# EAGLE design Sprite_CC1310_Development (EAGLE 8.5.2)
Assembly variants: hdmid
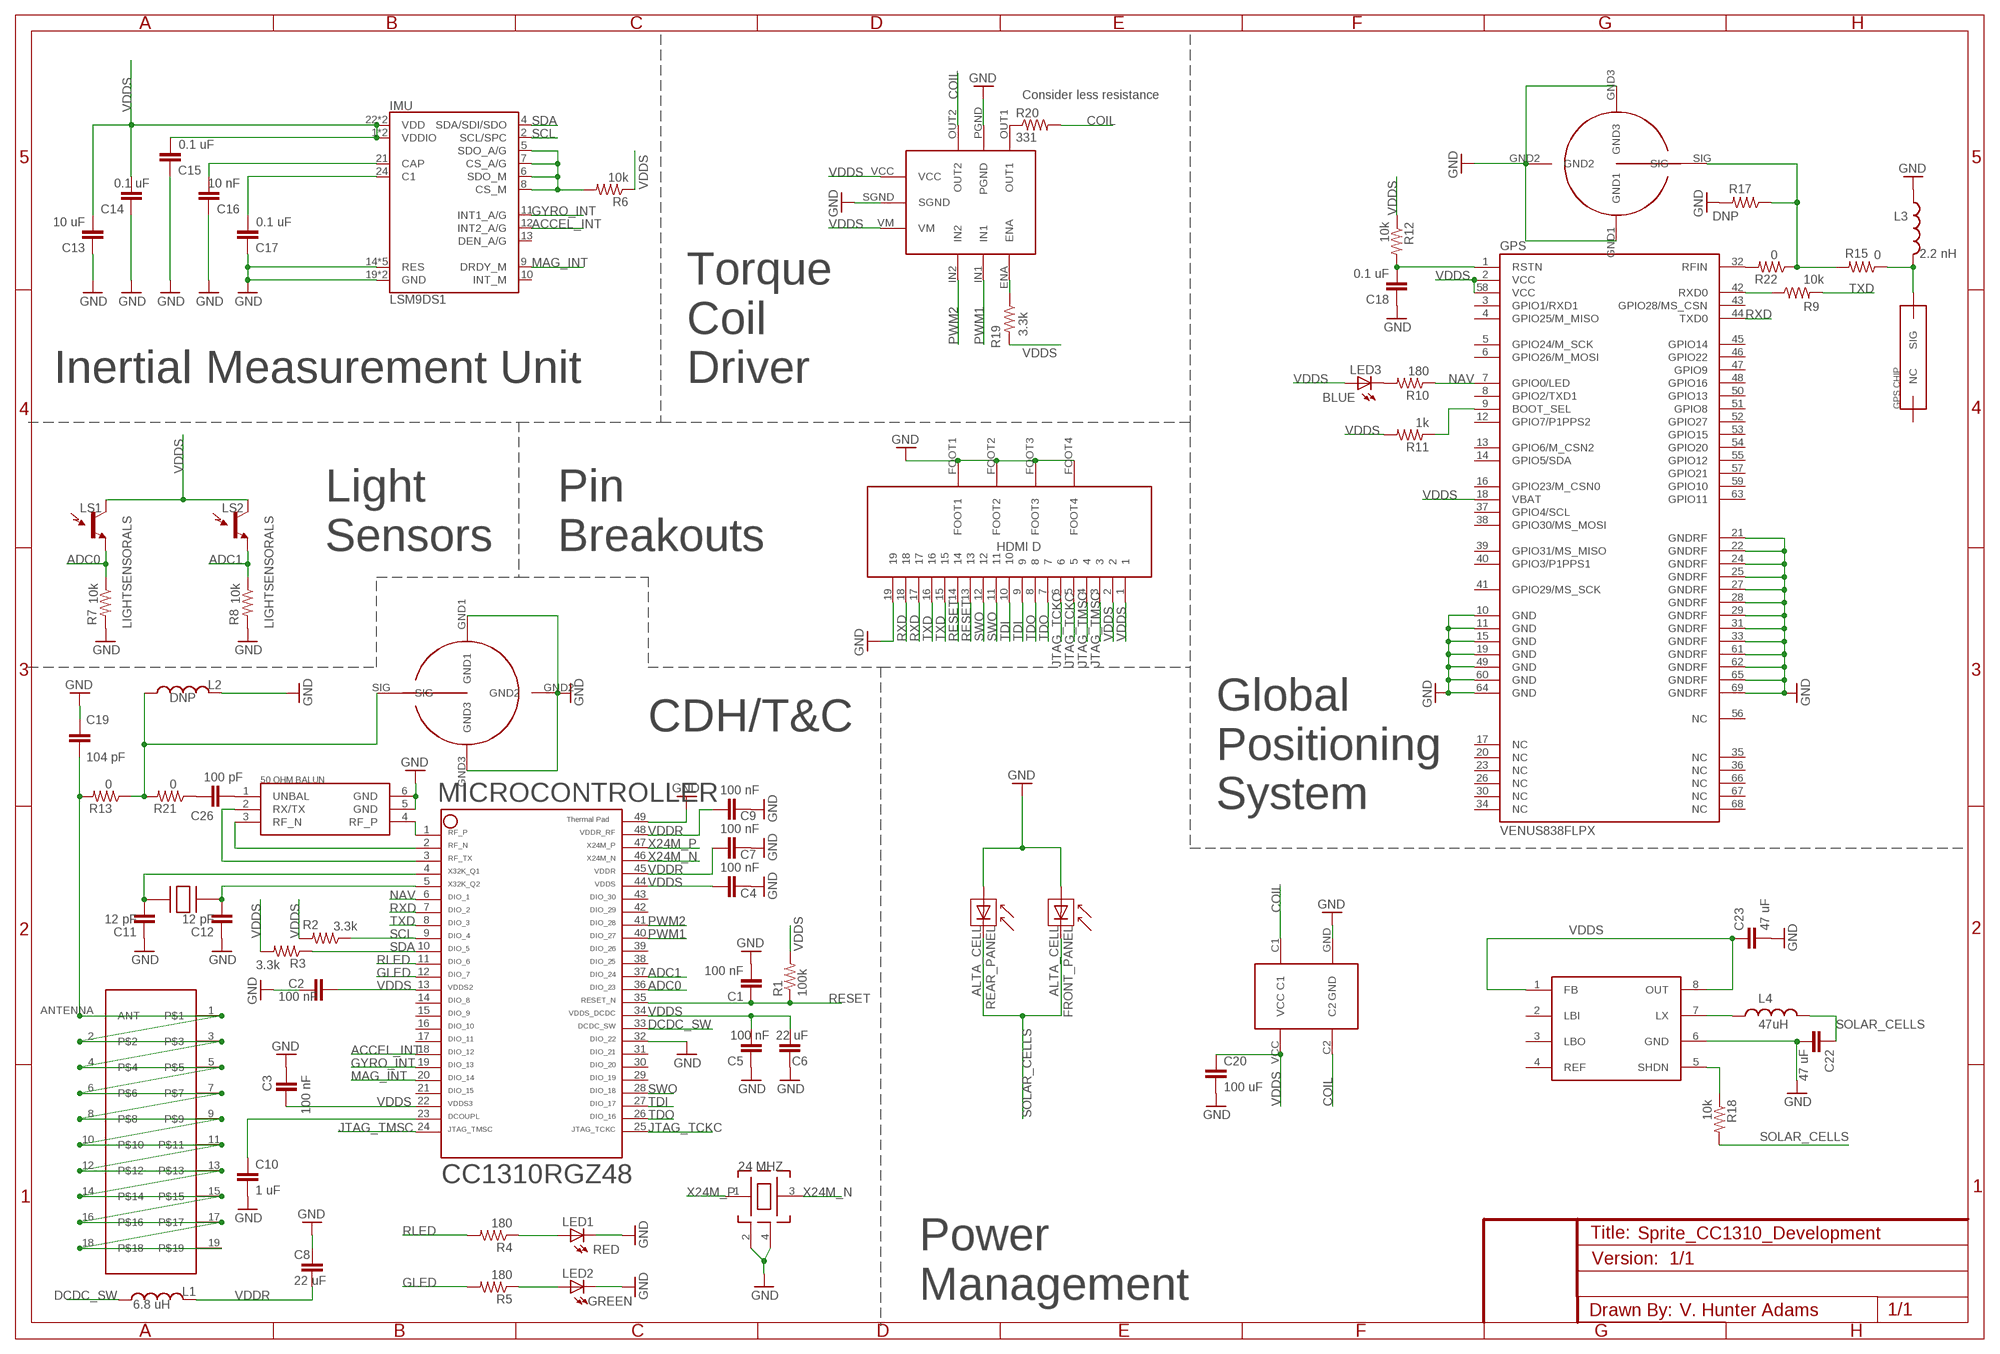
[diagram p0: schematic, sheet 1]

## Parts
32.768  FC-135  [FC-135]
BALUN  JOHANSON_BALUN  [JOHANSON_BALUN]
C1  100 nF  CAP0402-CAP  [0402-CAP]
C2  100 nF  CAP0402-CAP  [0402-CAP]
C3  100 nF  CAP0402-CAP  [0402-CAP]
C4  100 nF  CAP0402-CAP  [0402-CAP]
C5  100 nF  CAP0402-CAP  [0402-CAP]
C6  22 uF  CAP0402-CAP  [0402-CAP]
C7  100 nF  CAP0402-CAP  [0402-CAP]
C8  22 uF  CAP0402-CAP  [0402-CAP]
C9  100 nF  CAP0402-CAP  [0402-CAP]
C10  1 uF  CAP0402-CAP  [0402-CAP]
C11  12 pF  CAP0402-CAP  [0402-CAP]
C12  12 pF  CAP0402-CAP  [0402-CAP]
C13  10 uF  CAP0402-CAP  [0402-CAP]
C14  0.1 uF  CAP0402-CAP  [0402-CAP]
C15  0.1 uF  CAP0402-CAP  [0402-CAP]
C16  10 nF  CAP0402-CAP  [0402-CAP]
C17  0.1 uF  CAP0402-CAP  [0402-CAP]
C18  0.1 uF  CAP0402-CAP  [0402-CAP]
C19  104 pF  CAP0603-CAP  [0603-CAP]
C20  100 uF  CAP0805  [0805]
C22  47 uF  CAP0805  [0805]
C23  47 uF  CAP0805  [0805]
C26  100 pF  CAP0402-CAP  [0402-CAP]
FRONT_PANEL  ALTA_CELL  [ALTA_CELL]
GPS  VENUS838FLPX  [VENUS838FLPX]
IMU  LSM9DS1  [LGA24-8X4]
L1  6.8 uH  INDUCTOR0603  [0603]
L2  DNP  INDUCTOR0603  [0603]
L3  2.2 nH  INDUCTOR0603  [0603]
L4  47uH  INDUCTOR0603  [0603]
LED1  RED  LED0603  [LED-0603]
LED2  GREEN  LED0603  [LED-0603]
LED3  BLUE  LED0603  [LED-0603]
LS1  LIGHTSENSORALS  [ALS-PT19]
LS2  LIGHTSENSORALS  [ALS-PT19]
MICROCONTROLLER  CC1310  [CC1310]
R1  100k  RESISTOR0402-RES  [0402-RES]
R2  3.3k  RESISTOR0402-RES  [0402-RES]
R3  3.3k  RESISTOR0402-RES  [0402-RES]
R4  180  RESISTOR0402-RES  [0402-RES]
R5  180  RESISTOR0402-RES  [0402-RES]
R6  10k  RESISTOR0402-RES  [0402-RES]
R7  10k  RESISTOR0402-RES  [0402-RES]
R8  10k  RESISTOR0402-RES  [0402-RES]
R9  10k  RESISTOR0402-RES  [0402-RES]
R10  180  RESISTOR0402-RES  [0402-RES]
R11  1k  RESISTOR0402-RES  [0402-RES]
R12  10k  RESISTOR0402-RES  [0402-RES]
R13  0  RESISTOR0603-RES  [0603-RES]
R15  0  RESISTOR0603-RES  [0603-RES]
R17  DNP  RESISTOR0603-RES  [0603-RES]
R18  10k  RESISTOR0402-RES  [0402-RES]
R19  3.3k  RESISTOR0402-RES  [0402-RES]
R20  331  RESISTOR0402-RES  [0402-RES]
R21  0  RESISTOR0603-RES  [0603-RES]
R22  0  RESISTOR0603-RES  [0603-RES]
REAR_PANEL  ALTA_CELL  [ALTA_CELL]
TSX3225  TSX-3225  [TSX-3225]
U$1  HDMID  [HDMID]
U$2  LV8417CS  [LV8417CS]
U$3  MM5329-2700  [MM5829-2700]
U$4  PANASONIC_RECTIFIER  [PANASONIC_RECTIFIER]
U$5  JOHANSON_GPS_CHIP  [JOHANSON_GPS_CHIP]
U$6  PCB_ANTENNA  [PCB_ANTENNA]
U$7  MM5329-2700  [MM5829-2700]
U$8  L6920  [L6920]

## Nets
ACCEL_INT: IMU.12(INT2_A/G) MICROCONTROLLER.18
ADC0: LS1.E(E1) MICROCONTROLLER.36 R7.1
ADC1: LS2.E(E1) MICROCONTROLLER.37 R8.1
ANTENNA: C19.2 R13.2 U$6.1 U$6.2 U$6.3 U$6.4 U$6.5 U$6.6 U$6.7 U$6.8 U$6.9 U$6.10 U$6.11 U$6.12 U$6.13 U$6.14 U$6.15 U$6.16 U$6.17 U$6.18 U$6.19 U$6.ANTENNA(ANT)
COIL: R20.2 U$2.OUT2 U$4.C1 U$4.C2
DCDC_SW: L1.1 MICROCONTROLLER.33
GLED: MICROCONTROLLER.12 R5.2
GND: BALUN.5(GND) BALUN.6(GND) C1.2 C2.2 C3.2 C4.2 C5.2 C6.2 C7.2 C8.2 C9.2 C10.2 C11.2 C12.2 C13.2 C14.2 C15.2 C16.2 C17.2 C18.2 C19.1 C20.2 C22.2 C23.2 FRONT_PANEL.- GPS.10(GND) GPS.11(GND) GPS.15(GND) GPS.19(GND) GPS.21(GNDRF) GPS.22(GNDRF) GPS.24(GNDRF) GPS.25(GNDRF) GPS.27(GNDRF) GPS.28(GNDRF) GPS.29(GNDRF) GPS.31(GNDRF) GPS.33(GNDRF) GPS.49(GND) GPS.60(GND) GPS.61(GNDRF) GPS.62(GNDRF) GPS.64(GND) GPS.65(GNDRF) GPS.69(GNDRF) IMU.14(RES) IMU.15(RES) IMU.16(RES) IMU.17(RES) IMU.18(RES) IMU.19(GND) IMU.20(GND) L2.2 L3.1 LED1.C LED2.C MICROCONTROLLER.32 MICROCONTROLLER.49 R7.2 R8.2 R17.2 REAR_PANEL.- TSX3225.2 TSX3225.4 U$1.19 U$1.FOOT1 U$1.FOOT2 U$1.FOOT3 U$1.FOOT4 U$2.PGND U$2.SGND U$3.GND1 U$3.GND2 U$3.GND3 U$4.GND U$7.GND1 U$7.GND2 U$7.GND3 U$8.6(GND)
GYRO_INT: IMU.11(INT1_A/G) MICROCONTROLLER.19
JTAG_TCKC: MICROCONTROLLER.25 U$1.5 U$1.6
JTAG_TMSC: MICROCONTROLLER.24 U$1.3 U$1.4
MAG_INT: IMU.9(DRDY_M) MICROCONTROLLER.20
N$1: C10.1 MICROCONTROLLER.23
N$2: 32.768.P2 C11.1 MICROCONTROLLER.4
N$3: 32.768.P1 C12.1 MICROCONTROLLER.5
N$4: LED1.A R4.1
N$5: LED2.A R5.1
N$6: IMU.5(SDO_A/G) IMU.6(SDO_M) IMU.7(CS_A/G) IMU.8(CS_M) R6.2
N$7: GPS.42(RXD0) R9.1
N$8: C16.1 IMU.21(CAP)
N$9: C17.1 IMU.24(C1)
N$11: LED3.C R10.2
N$12: GPS.9(BOOT_SEL) R11.1
N$13: C18.1 GPS.1(RSTN) R12.2
N$14: R15.2 R17.1 R22.1 U$7.SIG
N$15: L3.2 R15.1 U$5.SIG
N$19: R19.1 U$2.ENA
N$20: R20.1 U$2.OUT1
N$21: BALUN.1(UNBAL) C26.2
N$22: BALUN.4(RF_P) MICROCONTROLLER.1
N$23: BALUN.3(RF_N) MICROCONTROLLER.2
N$24: BALUN.2(RX/TX) MICROCONTROLLER.3
N$25: GPS.32(RFIN) R22.2
N$26: L2.1 R13.1 R21.2 U$3.SIG
N$27: C26.1 R21.1
N$41: R18.1 U$8.5(SHDN)
N$48: L4.1 U$8.7(LX)
NAV: GPS.7(GPIO0/LED) MICROCONTROLLER.6 R10.1
PWM1: MICROCONTROLLER.40 U$2.IN1
PWM2: MICROCONTROLLER.41 U$2.IN2
RESET: C1.1 MICROCONTROLLER.35 R1.1 U$1.13 U$1.14
RLED: MICROCONTROLLER.11 R4.2
RXD: GPS.44(TXD0) MICROCONTROLLER.7 U$1.17 U$1.18
SCL: IMU.2(SCL/SPC) MICROCONTROLLER.9 R2.1
SDA: IMU.4(SDA/SDI/SDO) MICROCONTROLLER.10 R3.1
SOLAR_CELLS: C22.1 FRONT_PANEL.+ L4.2 R18.2 REAR_PANEL.+
SWO: MICROCONTROLLER.28 U$1.11 U$1.12
TDI: MICROCONTROLLER.27 U$1.9 U$1.10
TDO: MICROCONTROLLER.26 U$1.7 U$1.8
TXD: MICROCONTROLLER.8 R9.2 U$1.15 U$1.16
VDDR: C7.1 C8.1 C9.1 L1.2 MICROCONTROLLER.45 MICROCONTROLLER.48
VDDS: C2.1 C3.1 C4.1 C5.1 C6.1 C13.1 C14.1 C15.1 C20.1 C23.1 GPS.2(VCC) GPS.18(VBAT) GPS.58(VCC) IMU.1(VDDIO) IMU.3(VDDIO) IMU.22(VDD) IMU.23(VDD) LED3.A LS1.C(C1) LS2.C(C1) MICROCONTROLLER.13 MICROCONTROLLER.22 MICROCONTROLLER.34 MICROCONTROLLER.44 R1.2 R2.2 R3.2 R6.1 R11.2 R12.1 R19.2 U$1.1 U$1.2 U$2.VCC U$2.VM U$4.VCC U$8.1(FB) U$8.8(OUT)
X24M_N: MICROCONTROLLER.46 TSX3225.3
X24M_P: MICROCONTROLLER.47 TSX3225.1
Unconnected: GPS.3(GPIO1/RXD1) GPS.4(GPIO25/M_MISO) GPS.5(GPIO24/M_SCK) GPS.6(GPIO26/M_MOSI) GPS.8(GPIO2/TXD1) GPS.12(GPIO7/P1PPS2) GPS.13(GPIO6/M_CSN2) GPS.14(GPIO5/SDA) GPS.16(GPIO23/M_CSN0) GPS.17(NC) GPS.20(NC) GPS.23(NC) GPS.26(NC) GPS.30(NC) GPS.34(NC) GPS.35(NC) GPS.36(NC) GPS.37(GPIO4/SCL) GPS.38(GPIO30/MS_MOSI) GPS.39(GPIO31/MS_MISO) GPS.40(GPIO3/P1PPS1) GPS.41(GPIO29/MS_SCK) GPS.43(GPIO28/MS_CSN) GPS.45(GPIO14) GPS.46(GPIO22) GPS.47(GPIO9) GPS.48(GPIO16) GPS.50(GPIO13) GPS.51(GPIO8) GPS.52(GPIO27) GPS.53(GPIO15) GPS.54(GPIO20) GPS.55(GPIO12) GPS.56(NC) GPS.57(GPIO21) GPS.59(GPIO10) GPS.63(GPIO11) GPS.66(NC) GPS.67(NC) GPS.68(NC) IMU.10(INT_M) IMU.13(DEN_A/G) MICROCONTROLLER.14 MICROCONTROLLER.15 MICROCONTROLLER.16 MICROCONTROLLER.17 MICROCONTROLLER.21 MICROCONTROLLER.29 MICROCONTROLLER.30 MICROCONTROLLER.31 MICROCONTROLLER.38 MICROCONTROLLER.39 MICROCONTROLLER.42 MICROCONTROLLER.43 U$5.NC U$8.2(LBI) U$8.3(LBO) U$8.4(REF)

## Notes on the sheet
- Consider less resistance
- Inertial Measurement Unit
- Torque
  Coil
  Driver
- Light
  Sensors
- Pin
  Breakouts
- CDH/T&C
- Global
  Positioning
  System
- Power
  Management

## Library data of the parts
32.768 = FC-135:FC-135: FC-135 32.768KA-AG0
BALUN = JOHANSON_BALUN:JOHANSON_BALUN
C1-C20 C22 C23 C26 = SparkFun:CAP: Capacitor Standard 0603 ceramic capacitor, and 0.1" leaded capacitor.
FRONT_PANEL REAR_PANEL = ALTA_CELL:ALTA_CELL
GPS = VENUS838FLPX:VENUS838FLPX: Venus838FLPx-L
IMU = SparkFun-Sensors:LSM9DS1: LSM9DS1 3D accelerometer, gyroscope & magnetometer The LSM9DS1 is a system-in-package featuring a 3D digital linear acceleration sensor, a 3D digital angular rate sensor, and a 3D digital magnetic sensor. The LSM9DS1 has a linear acceleration full scale of ±2g/±4g/±8/±16 g, a magnetic field full scale of ±4/±8/±12/±16 gauss and an angular rate of ±245/±500/±2000 dps. The LSM9DS1 includes an I2 C serial bus interface supporting standard and fast mode (100 kHz and 400 kHz) and an SPI serial standard interface. Magnetic, accelerometer and gyroscope sensing can be enabled or set in power-down mode separately for smart power management. The LSM9DS1 is available in a plastic land grid array package (LGA) and it is guaranteed to operate over an extended temperature range from -40 °C to +85 °C.; PROD_ID: IC-12536
L1-L4 = SparkFun:INDUCTOR: Inductors Basic Inductor/Choke - 0603 and 1206. Footprints are not proven and vary greatly between part numbers.
LED1-LED3 = SparkFun:LED: LEDs Standard schematic elements and footprints for 5mm, 3mm, 1206, and 0603 sized LEDs. 5mm - Spark Fun Electronics SKU : COM-00529 (and others)
LS1 LS2 = SparkFun-Sensors:LIGHTSENSOR: Ambient Light Sensor Simple light detection sensor. Output varies with light intensity input. Spark Fun Electronics SKU : COM-08348; PROD_ID: IC-11836
MICROCONTROLLER = CC1310RGZ48:CC1310: CC1310 RGZ48 package
R1-R13 R15 R17-R22 = SparkFun:RESISTOR: Resistor Basic schematic elements and footprints for 0603, 1206, and PTH resistors.
TSX3225 = TSX-3225:TSX-3225
U$1 = HDMID:HDMID
U$2 = LV8417CS:LV8417CS
U$3 U$7 = MM5329-2700:MM5329-2700
U$4 = Panasonic_Rectifier:PANASONIC_RECTIFIER
U$5 = johanson_gps_chip:JOHANSON_GPS_CHIP
U$6 = PCB_ANTENNA:PCB_ANTENNA
U$8 = L6920:L6920

## Board
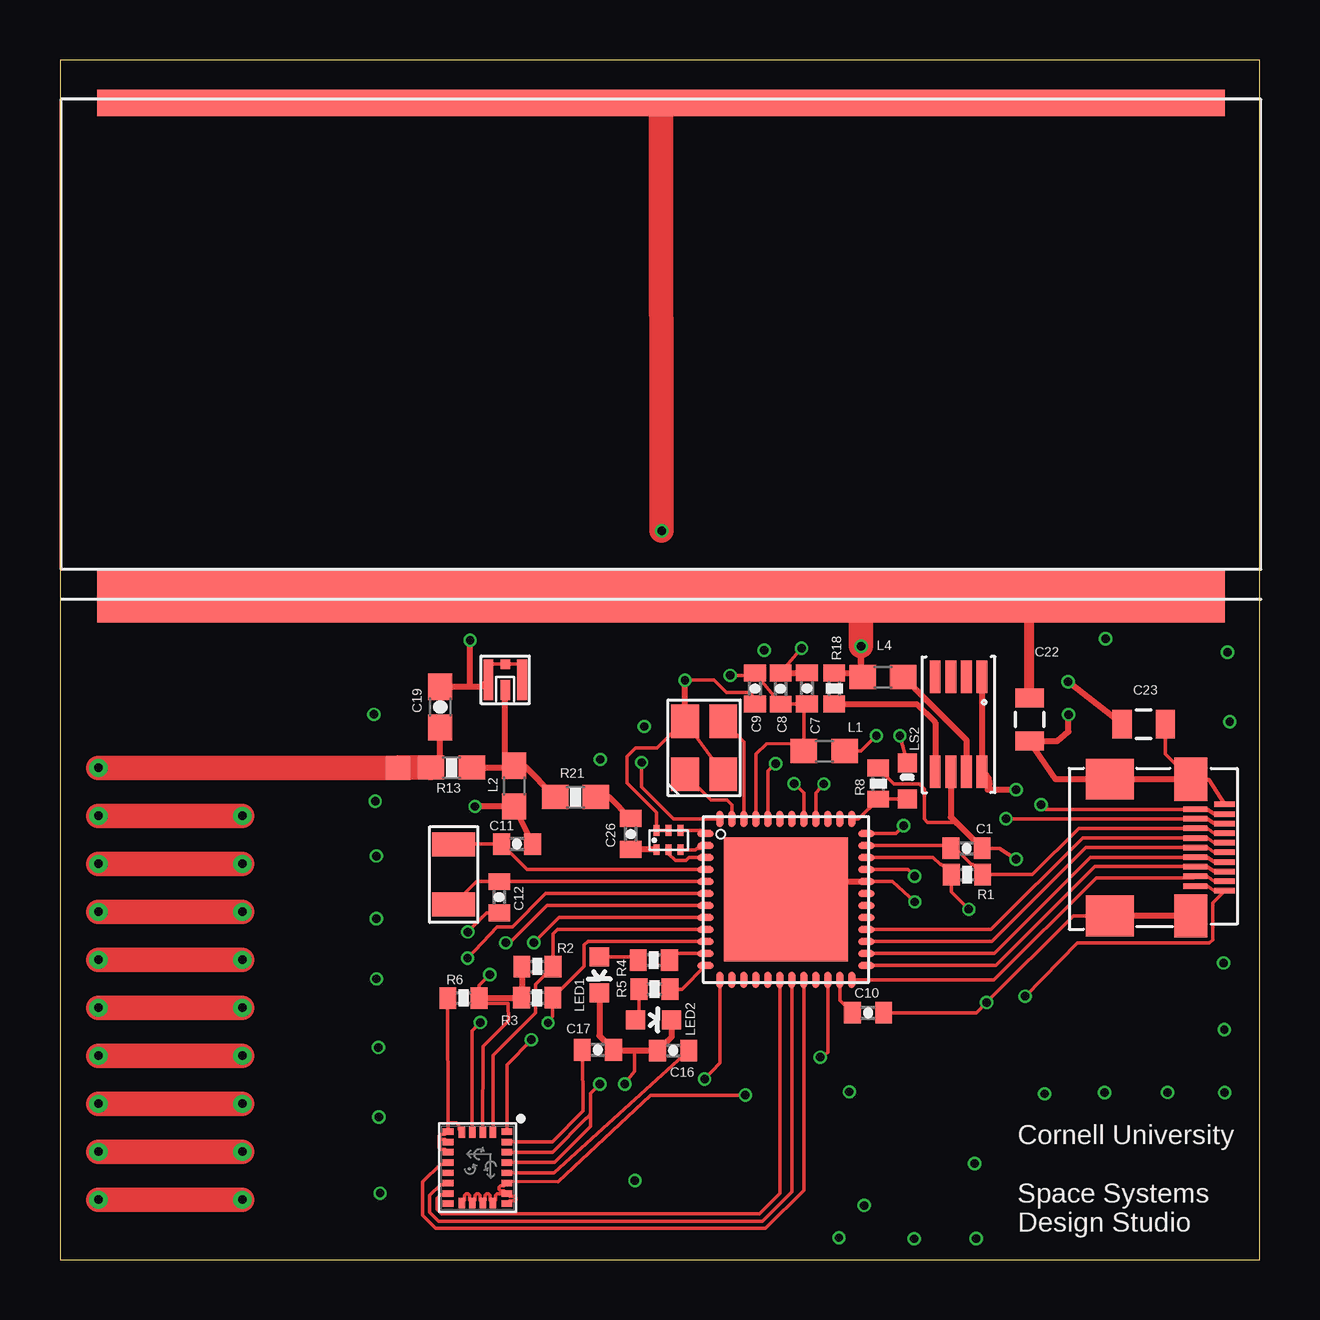
[diagram p1: board, top side]
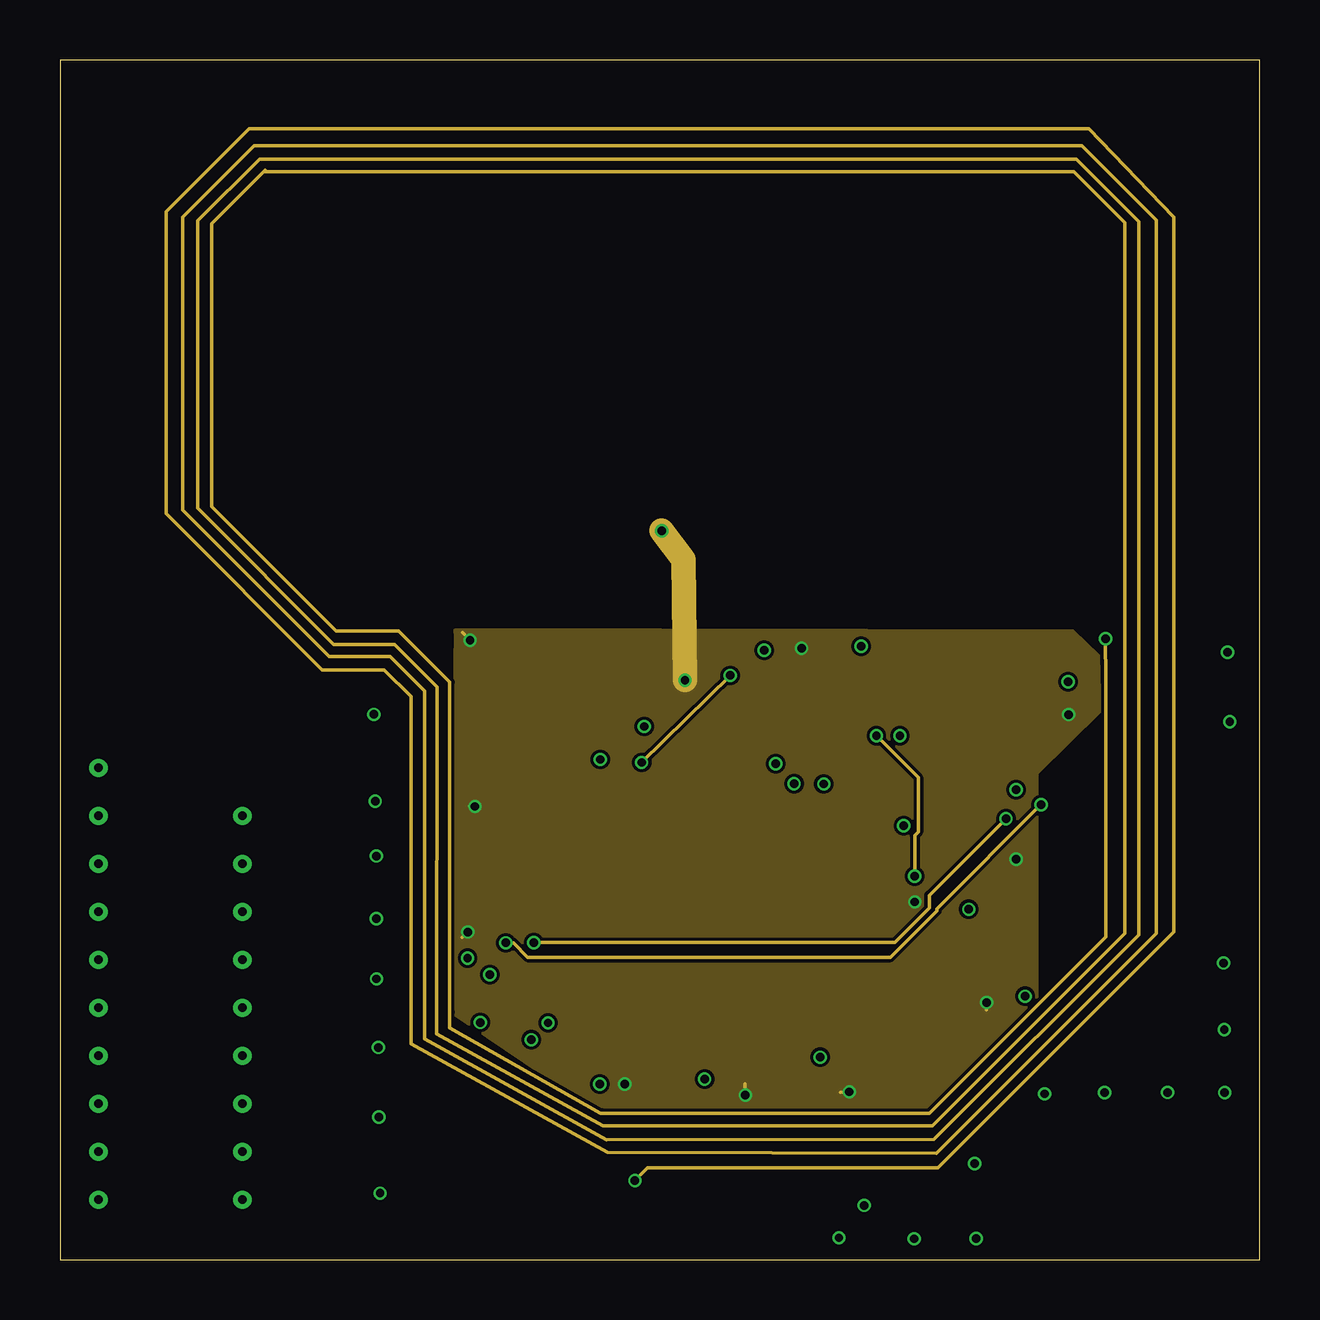
[diagram p2: board, inner layer Route2]
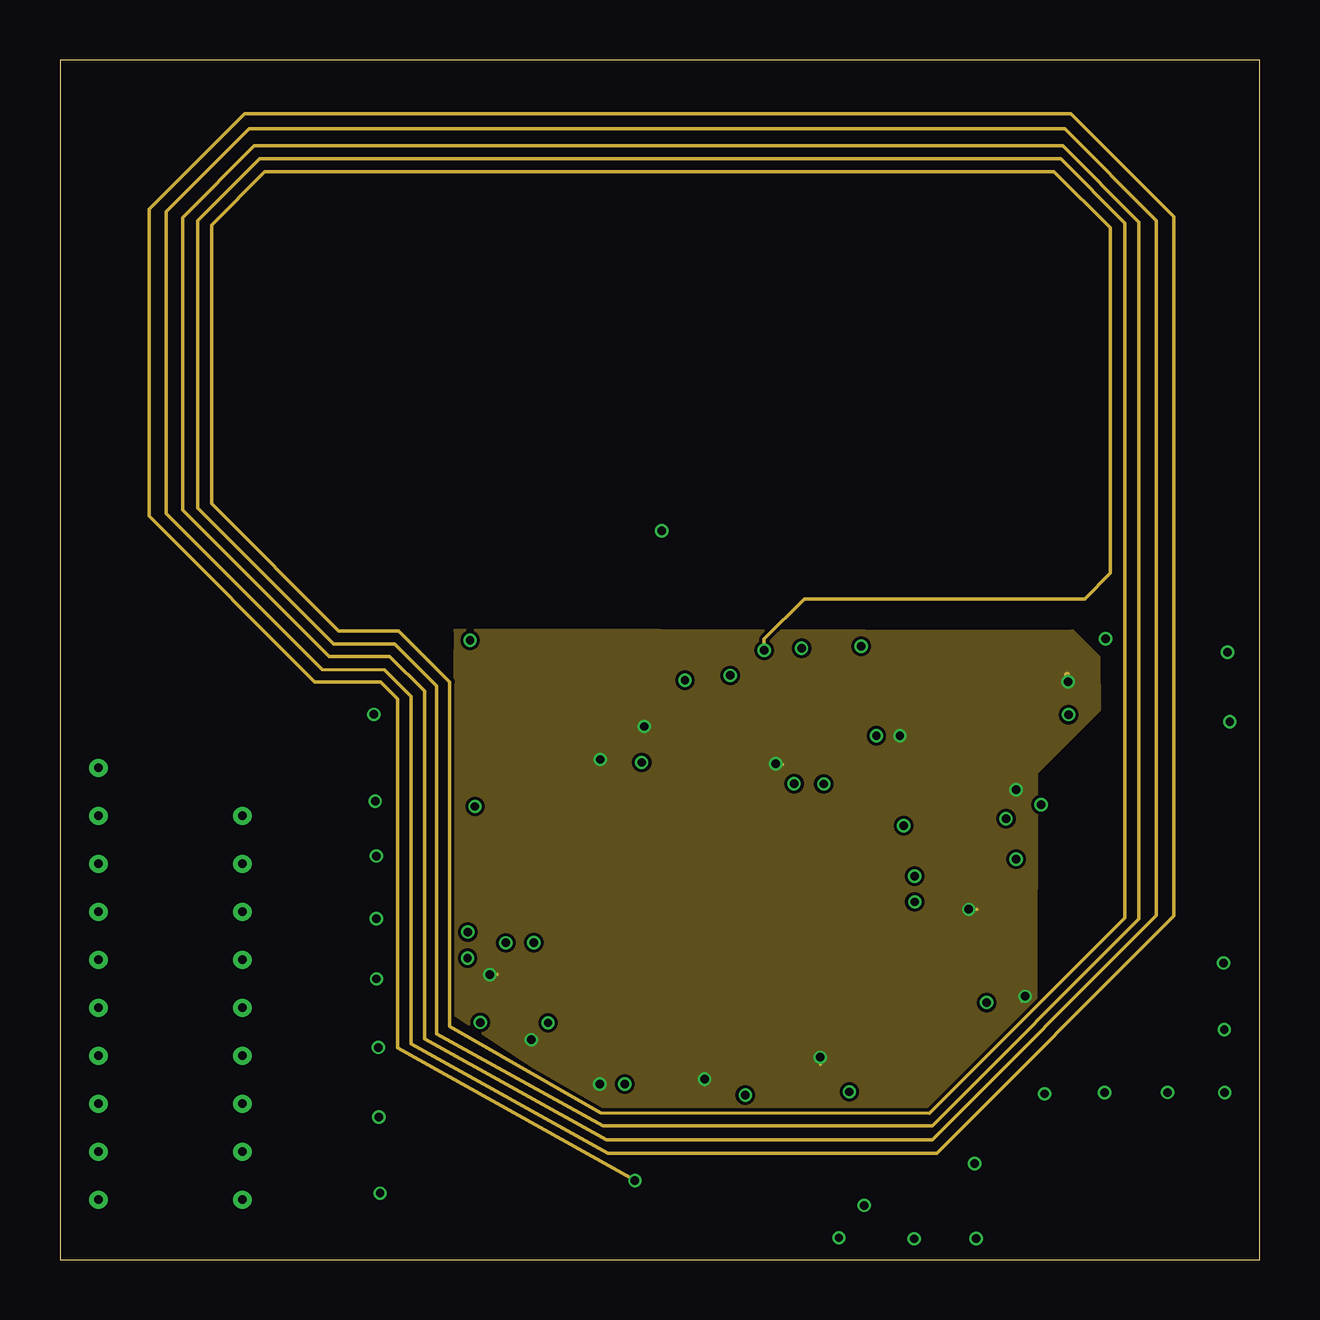
[diagram p3: board, inner layer Route15]
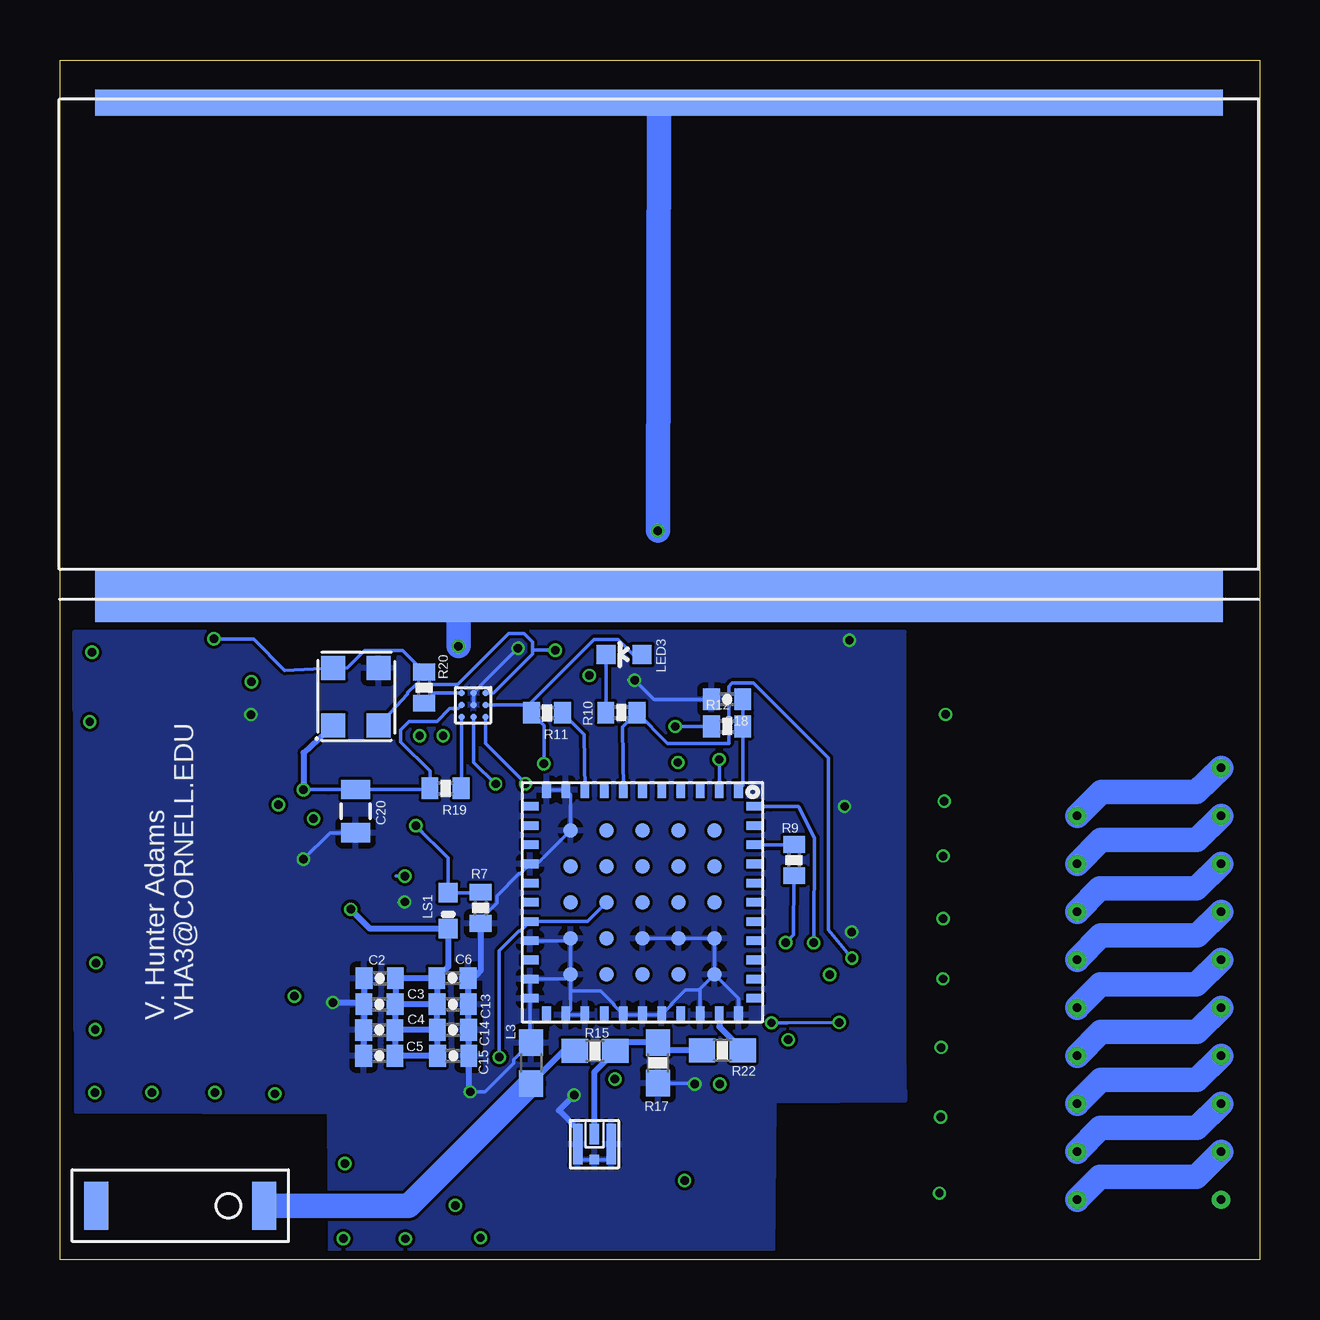
[diagram p4: board, bottom side, seen from below]

Size 50 x 50 mm. Coordinates in mm from the lower left corner, seen from the top.
Outline: 0,0 50,0 50,50 0,50 0,0
Copper layers (1*2*15*16): Top 0.035559375mm / dielectric 0.17018125mm / Route2 0.01778125mm / dielectric 47mil / Route15 0.01778125mm / dielectric 0.17018125mm / Bottom 0.035559375mm
Design rules "oshpark-4layer": minimum track width 5mil, minimum drill 10mil, track to track 5mil, track to pad 5mil, pad to pad 5mil, via to via 5mil, smd to smd 5mil, copper to edge 15mil, drill to drill 6mil, minimum pad ring 4mil, minimum via ring 4mil, stop-mask expansion 2.5mil, vias tented up to drill 0mil, thermal gap 10mil

### Footprints (pad centres in the part's own frame; a part is rotated, then mirrored left to right if it is on the bottom)
FC-135 = smd 1 x 1.8: P1 -1.25,0; P2 1.25,0
JOHANSON_BALUN = smd 0.45 x 0.25: 1 -0.4,0.5; 2 -0.4,0; 3 -0.4,-0.5; 4 0.4,-0.5; 5 0.4,0; 6 0.4,0.5
0402-CAP = smd 0.7 x 0.9: 1 -0.65,0; 2 0.65,0
0603-CAP = smd 1.1 x 1: 1 -0.85,0; 2 0.85,0
0805 = smd 0.8 x 1.2: 1 -0.9,0; 2 0.9,0
ALTA_CELL = smd 47 x 2.2: + 0,10.9 | smd 47 x 1.1: - 0,-9.65
VENUS838FLPX = smd 0.7 x 0.36: 1 -4.69,4; 2 -4.69,3.2; 3 -4.69,2.4; 4 -4.69,1.6; 5 -4.69,0.8; 6 -4.69,0; 7 -4.69,-0.8; 8 -4.69,-1.6; 9 -4.69,-2.4; 10 -4.69,-3.2; 11 -4.69,-4; 23 4.69,-4; 24 4.69,-3.2; 25 4.69,-2.4; 26 4.69,-1.6; 27 4.69,-0.8; 28 4.69,0; 29 4.69,0.8; 30 4.69,1.6; 31 4.69,2.4; 32 4.69,3.2; 33 4.69,4 | smd 0.36 x 0.7: 12 -4,-4.69; 13 -3.2,-4.69; 14 -2.4,-4.69; 15 -1.6,-4.69; 16 -0.8,-4.69; 17 0,-4.69; 18 0.8,-4.69; 19 1.6,-4.69; 20 2.4,-4.69; 21 3.2,-4.69; 22 4,-4.69; 34 4,4.69; 35 3.2,4.69; 36 2.4,4.69; 37 1.6,4.69; 38 0.8,4.69; 39 0,4.69; 40 -0.8,4.69; 41 -1.6,4.69; 42 -2.4,4.69; 43 -3.2,4.69; 44 -4,4.69 | smd 0.6 x 0.6: 45 -3,3; 46 -3,1.5; 47 -3,0; 48 -3,-1.5; 49 -3,-3; 50 -1.5,3; 51 -1.5,1.5; 52 -1.5,0; 53 -1.5,-1.5; 54 -1.5,-3; 55 0,3; 56 0,1.5; 57 0,0; 58 0,-1.5; 59 0,-3; 60 1.5,3; 61 1.5,1.5; 62 1.5,0; 63 1.5,-1.5; 64 1.5,-3; 65 3,3; 66 3,1.5; 67 3,0; 68 3,-1.5; 69 3,-3
LGA24-8X4 = smd 0.27 x 0.45: 1 -1.505,1.225; 6 -1.505,-1.225; 7 -1.075,-1.225; 8 -0.645,-1.225; 9 -0.215,-1.225; 10 0.215,-1.225; 11 0.645,-1.225; 12 1.075,-1.225; 13 1.505,-1.225; 18 1.505,1.225; 19 1.075,1.225; 20 0.645,1.225; 21 0.215,1.225; 22 -0.215,1.225; 23 -0.645,1.225; 24 -1.075,1.225 | smd 0.45 x 0.27: 2 -1.475,0.645; 3 -1.475,0.215; 4 -1.475,-0.215; 5 -1.475,-0.645; 14 1.475,-0.645; 15 1.475,-0.215; 16 1.475,0.215; 17 1.475,0.645
0603 = smd 1.1 x 1: 1 -0.85,0; 2 0.85,0
LED-0603 = smd 0.8 x 0.8: A 0,-0.75; C 0,0.75
ALS-PT19 = smd 0.8 x 0.8: C -0.75,0; E 0.75,0
CC1310 = smd 0.7 x 0.3: 1 -3.35,2.75; 2 -3.35,2.25; 3 -3.35,1.75; 4 -3.35,1.25; 5 -3.35,0.75; 6 -3.35,0.25; 7 -3.35,-0.25; 8 -3.35,-0.75; 9 -3.35,-1.25; 10 -3.35,-1.75; 11 -3.35,-2.25; 12 -3.35,-2.75; 25 3.35,-2.75; 26 3.35,-2.25; 27 3.35,-1.75; 28 3.35,-1.25; 29 3.35,-0.75; 30 3.35,-0.25; 31 3.35,0.25; 32 3.35,0.75; 33 3.35,1.25; 34 3.35,1.75; 35 3.35,2.25; 36 3.35,2.75 | smd 0.3 x 0.7: 13 -2.75,-3.35; 14 -2.25,-3.35; 15 -1.75,-3.35; 16 -1.25,-3.35; 17 -0.75,-3.35; 18 -0.25,-3.35; 19 0.25,-3.35; 20 0.75,-3.35; 21 1.25,-3.35; 22 1.75,-3.35; 23 2.25,-3.35; 24 2.75,-3.35; 37 2.75,3.35; 38 2.25,3.35; 39 1.75,3.35; 40 1.25,3.35; 41 0.75,3.35; 42 0.25,3.35; 43 -0.25,3.35; 44 -0.75,3.35; 45 -1.25,3.35; 46 -1.75,3.35; 47 -2.25,3.35; 48 -2.75,3.35 | smd 5.15 x 5.15: 49 0,0
0402-RES = smd 0.7 x 0.9: 1 -0.65,0; 2 0.65,0
0603-RES = smd 1.1 x 1: 1 -0.85,0; 2 0.85,0
TSX-3225 = smd 1.4 x 1.15: 1 -1.1,0.8; 2 1.1,0.8; 3 1.1,-0.8; 4 -1.1,-0.8
HDMID = smd 0.23 x 0.85: 1 1.8,6.475; 3 1.4,6.475; 5 1,6.475; 7 0.6,6.475; 9 0.2,6.475; 11 -0.2,6.475; 13 -0.6,6.475; 15 -1,6.475; 17 -1.4,6.475; 19 -1.8,6.475 | smd 0.23 x 1: 2 1.6,5.25; 4 1.2,5.25; 6 0.8,5.25; 8 0.4,5.25; 10 0,5.25; 12 -0.4,5.25; 14 -0.8,5.25; 16 -1.2,5.25; 18 -1.6,5.25 | smd 1.8 x 1.38: FOOT1 -2.85,5.06; FOOT2 2.85,5.06 | smd 1.7 x 2: FOOT3 -2.85,1.7; FOOT4 2.85,1.7
LV8417CS = smd 0.27 x 0.27: ENA -0.5,-0.5; IN1 0,-0.5; IN2 0.5,-0.5; OUT1 -0.5,0.5; OUT2 0.5,0.5; PGND 0,0.5; SGND 0,0; VCC -0.5,0; VM 0.5,0
MM5829-2700 = smd 0.4 x 1.7: GND1 -0.7,0; GND3 0.7,0 | smd 0.4 x 0.4: GND2 0,0.65 | smd 0.4 x 0.85: SIG 0,-0.425
PANASONIC_RECTIFIER = smd 1 x 1: C1 -0.95,1.2; C2 0.95,-1.2; GND 0.95,1.2; VCC -0.95,-1.2
JOHANSON_GPS_CHIP = smd 1 x 2: NC -3.5,0; SIG 3.5,0
PCB_ANTENNA = drill 0.35 pad 0.756: 1 -8.89,3.11; 2 -6.89,-2.89; 3 -6.89,3.11; 4 -4.89,-2.89; 5 -4.89,3.11; 6 -2.89,-2.89; 7 -2.89,3.11; 8 -0.89,-2.89; 9 -0.89,3.11; 10 1.11,-2.89; 11 1.11,3.11; 12 3.11,-2.89; 13 3.11,3.11; 14 5.11,-2.89; 15 5.11,3.11; 16 7.11,-2.89; 17 7.11,3.11; 18 9.11,-2.89; 19 9.11,3.11 | smd 1 x 1 bottom: ANTENNA -8.89,-9.39
L6920 = smd 0.45 x 1.35: 1 -0.975,-1.975; 2 -0.325,-1.975; 3 0.325,-1.975; 4 0.975,-1.975; 5 0.975,1.975; 6 0.325,1.975; 7 -0.325,1.975; 8 -0.975,1.975

### Placement (x,y rotation side)
32.768  16.41,16.05 90 top
BALUN  25.37,17.48 90 top
C1  37.79,17.14 0 top
C2  36.67,11.72 180 bottom
C3  36.68,10.64 180 bottom
C4  36.69,9.56 180 bottom
C5  36.69,8.49 180 bottom
C6  33.64,11.73 0 bottom
C7  31.13,23.81 90 top
C8  30.04,23.8 90 top
C9  28.97,23.8 270 top
C10  33.68,10.29 0 top
C11  19.05,17.32 0 top
C12  18.31,15.1 270 top
C13  33.63,10.64 0 bottom
C14  33.62,9.57 0 bottom
C15  33.61,8.49 0 bottom
C16  25.56,8.71 180 top
C17  22.42,8.74 0 top
C18  22.19,23.35 180 bottom
C19  15.85,23.03 270 top
C20  37.68,18.69 270 bottom
C22  40.41,22.51 270 top
C23  45.17,22.31 0 top
C26  23.79,17.74 270 top
FRONT_PANEL  25.03,38.57 180 bottom
GPS  25.72,14.89 270 bottom
IMU  17.4,3.83 270 top
L1  31.86,21.19 180 top
L2  18.93,19.73 270 top
L3  30.36,8.19 270 bottom
L4  34.3,24.28 180 top
LED1  22.48,11.86 180 top
LED2  24.74,9.99 270 top
LED3  26.49,25.22 90 bottom
LS1  33.82,14.54 90 bottom
LS2  35.32,19.95 270 top
MICROCONTROLLER  30.26,15.01 0 top
R1  37.81,16.04 180 top
R2  19.9,12.21 180 top
R3  19.89,10.91 180 top
R4  24.75,12.48 0 top
R5  24.78,11.27 0 top
R6  16.82,10.9 180 top
R7  32.47,14.66 270 bottom
R8  34.11,19.84 90 top
R9  19.4,16.65 270 bottom
R10  26.6,22.8 180 bottom
R11  29.7,22.79 180 bottom
R12  22.19,22.22 0 bottom
R13  16.32,20.51 180 top
R15  27.7,8.69 0 bottom
R17  25.08,8.2 270 bottom
R18  32.27,23.8 90 top
R19  33.93,19.64 180 bottom
R20  34.82,23.84 90 bottom
R21  21.49,19.28 180 top
R22  22.39,8.72 0 bottom
REAR_PANEL  25.05,38.56 180 top
TSX3225  26.85,21.33 90 top
U$1  42.07,17.17 270 top
U$2  32.77,23.11 0 bottom
U$3  18.56,24.16 0 top
U$4  37.66,23.46 0 bottom
U$5  44.98,2.24 0 bottom
U$6  4.71,11.61 270 bottom
U$7  27.72,4.81 180 bottom
U$8  37.46,22.31 180 top

### Tracks (layer width: path | path; a pad name or v marks a point on that pad's centre or on a via)
ACCEL_INT
  Top 0.152: MICROCONTROLLER.18 30.01,2.75 29.16,1.9 15.91,1.9 15.72,2.1 15.72,2.56 15.86,2.69 16.11,2.69 IMU.12
ADC0  (via drill 0.35)
  Top 0.152: MICROCONTROLLER.36 34.85,17.76 v35.17,18.08
  Bottom 0.152: 34.91,17.82 v35.17,18.08 33.82,16.73 LS1.E 32.49,15.29 arc-90 R7.1
ADC1
  Top 0.152: MICROCONTROLLER.37 33.28,18.36 R8.1 34.12,19.2 LS2.E
ANTENNA
  Top 0.152: 15.5,20.54 15.85,20.89
  Top 0.254: 15.85,20.89 C19.2 | R13.2 15.5,20.54
  Top 1.016: U$6.2 U$6.3 | U$6.4 U$6.5 | U$6.6 U$6.7 | U$6.8 U$6.9 | U$6.10 U$6.11 | U$6.12 U$6.13 | U$6.14 U$6.15 | U$6.16 U$6.17 | U$6.18 U$6.19 | U$6.1 U$6.ANTENNA R13.2 15.45,20.49
  Bottom 1.016: U$6.1 2.63,19.5 6.6,19.5 U$6.2 | U$6.3 2.62,17.48 6.62,17.48 U$6.4 | U$6.5 2.64,15.46 6.66,15.46 7.6,14.52 U$6.6 | U$6.7 2.6,13.5 6.61,13.5 U$6.8 | U$6.9 2.62,11.47 6.64,11.47 7.6,10.51 U$6.10 | U$6.11 2.62,9.48 6.62,9.48 U$6.12 | U$6.12 | U$6.13 2.61,7.49 6.62,7.49 U$6.14 | U$6.15 2.62,5.48 6.63,5.48 U$6.16 | U$6.17 2.64,3.45 6.67,3.45 7.6,2.52 U$6.18
COIL  (via drill 0.35)
  Route2 0.152: v43.58,25.87 43.59,24.18 43.59,13.44 36.24,6.1 22.57,6.1 22.53,6.1 16.24,9.65 16.25,10.31 | 16.25,10.31 16.24,10.32 | 16.25,10.31 16.25,24.06 14.12,26.19 11.52,26.19 6.32,31.39 6.32,43.17 8.48,45.34 | 8.48,45.34 8.56,45.41 | 8.48,45.34 42.26,45.34 44.38,43.23 44.38,13.59 36.36,5.58 22.63,5.58 15.7,9.4 15.72,23.87 13.95,25.64 11.41,25.64 5.75,31.31 5.75,43.3 8.31,45.87 42.37,45.87 44.98,43.26 44.98,13.54 36.44,5 22.78,4.99 15.2,9.19 15.2,23.69 13.75,25.14 11.22,25.14 5.12,31.24 5.12,43.44 8.1,46.42 42.6,46.42 45.71,43.31 45.71,13.6 36.53,4.43 22.82,4.46 14.64,8.99 14.63,23.47 13.52,24.58 10.94,24.58 4.43,31.09 4.43,43.67 7.88,47.13 42.89,47.13 46.42,43.45 46.42,13.65 36.59,3.82 24.49,3.82 v23.96,3.3
  Route15 0.152: v29.35,25.4 29.35,25.86 31.03,27.54 42.71,27.54 43.78,28.61 43.78,43 41.43,45.34 8.53,45.34 6.31,43.12 6.31,31.5 11.62,26.19 14.12,26.19 16.24,24.07 16.24,9.72 22.53,6.11 36.24,6.09 44.38,14.23 44.38,43.21 41.71,45.88 8.32,45.88 5.74,43.29 5.74,31.33 11.42,25.65 13.94,25.65 15.69,23.9 15.7,9.4 22.64,5.58 36.36,5.58 44.98,14.19 44.98,43.24 41.8,46.42 8.1,46.42 5.11,43.43 5.11,31.25 11.22,25.14 13.75,25.14 15.19,23.7 15.2,9.2 22.79,4.99 36.36,5 45.71,14.34 45.71,43.31 41.89,47.13 7.88,47.13 4.43,43.67 4.42,31.09 10.93,24.59 13.52,24.58 14.63,23.47 14.64,8.99 22.84,4.43 36.54,4.43 46.42,14.31 46.42,43.47 42.13,47.77 7.69,47.77 3.71,43.79 3.71,30.98 10.62,24.08 13.37,24.08 14.08,23.37 14.08,8.81 v23.96,3.3
  Bottom 0.152: 30.3,25.4 30.3,25.23 31.92,23.61 U$2.OUT2 | 30.3,25.4 30.3,25.73 30.66,26.09 31.31,26.09 33.42,23.97 35.16,23.97 35.5,23.63 35.5,23.57 U$4.C2 | 30.3,25.4 v29.35,25.4 | 43.47,25.86 v43.58,25.87 v43.57,25.86 41.94,25.86 40.63,24.56 U$4.C1 38.03,24.66 37.3,25.39 35.73,25.39 R20.2
DCDC_SW  (via drill 0.35)
  Top 0.152: 33.85,16.26 MICROCONTROLLER.33 35.35,16.26 v35.63,15.98 | L1.1 33.39,21.19 v34.03,21.84
  Route2 0.152: v35.63,15.98 35.63,17.68 35.78,17.83 35.78,20.09 v34.03,21.84
  Bottom 0.152: v34.03,21.84 34.16,21.89 | v35.63,15.98 35.98,15.98
GLED
  Top 0.152: R5.2 25.92,11.27 MICROCONTROLLER.12
GND  (via drill 0.35)
  Top 0.152: MICROCONTROLLER.49 31.01,15.76 | TSX3225.4 TSX3225.2 26.05,22.5 24.88,21.32 23.99,21.32 23.64,20.97 23.64,19.87 24.87,18.64 BALUN.6 BALUN.5 | U$1.19 47.88,20.01 U$1.FOOT1 46.08,21.07 C23.2 | MICROCONTROLLER.32 34.7,15.76 v35.63,14.9 | IMU.18 18.74,2.44 18.94,2.44 19,2.5 19,2.58 18.94,2.64 18.74,2.64 IMU.19 | IMU.14 16.87,2.47 16.87,2.67 16.93,2.73 17.01,2.73 17.07,2.67 17.07,2.47 IMU.15 17.3,2.47 17.3,2.67 17.36,2.73 17.44,2.73 17.5,2.67 17.5,2.47 IMU.16 17.73,2.47 17.73,2.67 17.79,2.73 17.87,2.73 17.93,2.67 17.93,2.47 IMU.17 18.16,2.47 18.16,2.67 18.22,2.73 18.6,2.73 IMU.19 | IMU.19 18.51,2.87 18.36,2.87 18.3,2.93 18.3,3.01 18.36,3.07 18.51,3.07 IMU.20 18.69,3.25 20.76,3.25 24.62,6.85 v28.57,6.85 | C1.2 39.16,17.14 v39.86,16.68 | v26.05,24.15 27.25,24.15 27.77,23.63 28.8,23.63 C9.2 | C12.2 17.78,14.45 17.41,14.07 17.41,14.08 v17,13.65 | U$1.FOOT4 42.23,14.32 v38.62,10.71 38.2,10.29 C10.2 | 23.95,8.71 23.95,7.84 v23.54,7.31 | C8.2 v30.91,25.48 | U$3.GND1 17.86,24.81 U$3.GND2 19.26,24.81 U$3.GND3 | R8.2 34.76,19.83 35.81,19.83 36.03,19.61 36.03,18.36 36.16,18.23 37.35,18.23 37.38,18.2
  Top 0.254: U$1.FOOT1 U$1.FOOT3 41.5,20.02 C22.2 41.57,21.61 42.04,22.01 v42.04,22.71 | 31.01,15.76 MICROCONTROLLER.32 | U$1.FOOT2 U$1.FOOT4 | 26.05,22.5 v26.05,24.15 | C11.2 L2.2 v17.3,18.88 | LED1.C 22.48,9.33 C17.2 23.1,8.71 23.95,8.71 C16.2 25.49,9.29 LED2.C | C7.2 30.93,24.38 30.86,24.45 C8.2 | U$3.GND1 17.57,23.88 17.09,23.88 | C19.1 17.09,23.88 | 19.26,24.81 | U$8.6 37.13,18.45 37.38,18.2 C1.2 | 17.09,23.88 v17.09,25.82
  Top 1.016: REAR_PANEL.- v25.08,30.38
  Route2 0.152: v39.86,16.68 39.98,16.63 | v17,13.65 16.75,13.44 | v17.3,18.88 17.07,18.91 | v32.9,6.99 32.53,6.98 | v38.62,10.71 38.62,10.41 | v23.54,7.31 23.57,7.14 | v28.57,6.85 28.55,7.33 | v30.91,25.48 31.04,25.61 | v17.09,25.82 16.78,26.13
  Route2 0.254: v42.04,22.71 42.11,22.87
  Route2 1.016: v26.05,24.15 25.98,29.19 v25.08,30.38
  Bottom 0.152: 26.3,24.15 v26.05,24.15 25.25,23.35 C18.2 | v35.63,14.9 35.88,14.88 | GPS.69 GPS.64 28.82,13.29 GPS.19 | GPS.25 GPS.24 28.72,10.4 28.72,11.19 | GPS.69 28.72,11.19 | GPS.31 23.32,11.24 | 23.32,11.24 23.32,11.29 GPS.65 | GPS.33 21.72,10.89 GPS.65 | GPS.11 GPS.10 28.72,19.38 GPS.49 30.12,16.49 GPS.15 30.8,16.1 30.86,16.1 31.79,15.16 31.79,14.87 32.47,14.19 R7.2 | GPS.69 28.92,11.69 GPS.21 GPS.22 30.41,9.09 L3.1 31.08,8.32 31.08,8.18 32.27,6.99 v32.9,6.99 | GPS.65 GPS.60 GPS.61 GPS.62 | R17.2 23.57,7.35 v23.54,7.31 | C20.2 38.75,17.79 v39.86,16.68 | U$2.SGND U$2.PGND 32.77,23.62 32.42,23.97 v30.91,25.48 | 28.72,11.19 27.46,11.19 26.91,10.64 26.91,10.59 GPS.27 GPS.28 GPS.29 24.53,10.59 24.53,10.64 23.93,11.24 23.32,11.24 | U$7.GND3 28.42,4.16 U$7.GND2 27.02,4.16 U$7.GND1
  Bottom 0.254: v28.57,6.85 29.2,6.21 28.42,5.43 U$7.GND3 | C2.2 C3.2 | C3.2 C4.2 C5.2 | C6.2 32.99,11.51 | 32.99,11.51 C13.2 C14.2 C15.2 32.96,7.05 v32.9,6.99 | v38.62,10.71 37.33,10.71 C3.2 | R7.2 32.47,12.03 32.99,11.51
  Bottom 1.016: FRONT_PANEL.- v25.08,30.38
  pour Route2: 16.48,26.08 16.22,10.37 22.51,6.12 36.22,6.17 40.73,10.61 40.71,20.26 43.34,22.85 43.28,25.18 42.23,26.2 16.51,26.26 16.46,26.21
  pour Bottom: 14.8,26.13 14.8,8.61 14.76,6.61 20.21,6.58 20.25,0.21 38.76,0.14 38.81,6.11 49.35,6.15 49.4,26.18 14.78,26.18 14.78,26.13
GYRO_INT
  Top 0.152: MICROCONTROLLER.19 30.51,2.82 29.28,1.6 15.79,1.6 15.42,1.97 15.42,2.68 15.85,3.12 16.11,3.12 IMU.11
JTAG_TCKC
  Top 0.152: U$1.5 48.12,16.17 47.82,16.37 U$1.6 43.13,16.38 39.01,12.26 MICROCONTROLLER.25
JTAG_TMSC
  Top 0.152: U$1.3 48.11,15.77 47.82,15.97 U$1.4 47.26,15.91 43.19,15.91 38.94,11.66 MICROCONTROLLER.24
MAG_INT
  Top 0.152: MICROCONTROLLER.20 31.01,2.89 29.41,1.29 15.66,1.29 15.11,1.84 15.11,3.23 15.86,3.98 16.11,3.98 IMU.9
N$1
  Top 0.152: MICROCONTROLLER.23 32.51,10.81 C10.1
N$2
  Top 0.152: MICROCONTROLLER.4 19.46,16.26 C11.1 16.43,17.32 32.768.P2
N$3
  Top 0.152: C12.1 MICROCONTROLLER.5 | C12.1 | 32.768.P1 17.37,15.76 C12.1
N$4
  Top 0.152: R4.1 24.1,12.61 LED1.A
N$5
  Top 0.152: R5.1 24.13,10.13 LED2.A
N$6
  Top 0.152: 16.18,5.69 IMU.6 16.06,5.22 15.86,5.22 15.8,5.16 15.8,5.08 | 16.18,5.69 R6.2 | IMU.5 16.64,5.42 16.64,5.57 16.52,5.69 16.18,5.69 | 15.8,5.08 15.86,5.02 16.06,5.02 IMU.7 | IMU.8 16.06,4.59 15.86,4.59 15.8,4.65 15.8,5.08
N$7
  Bottom 0.152: GPS.42 R9.1
N$8
  Top 0.152: IMU.21 20.59,3.62 C16.1
N$9
  Top 0.152: IMU.24 20.52,4.91 21.81,6.19 21.79,8.72 C17.1
N$10  (via drill 0.35)
  other vias: 48.55,6.95
N$11
  Bottom 0.152: LED3.C R10.2
N$12
  Bottom 0.152: GPS.9 28.15,21.89 R11.1
N$13
  Bottom 0.152: C18.1 R12.2 21.54,19.76 GPS.1
N$14
  Bottom 0.152: 24.75,8.72 R17.1 | 26.49,9.05 R15.2
  Bottom 0.254: R22.1 24.75,8.72 | R17.1 26.49,9.05 | R15.2 27.73,7.81 27.72,7.81 U$7.SIG
N$15
  Bottom 0.152: R15.1 29.01,8.69
  Bottom 0.254: L3.2 29.01,8.69
  Bottom 1.016: U$5.SIG 35.46,2.24 L3.2
N$17  (via drill 0.35)
  other vias: 46.17,6.96
N$18  (via drill 0.35)
  other vias: 43.55,6.95
N$19
  Bottom 0.152: R19.1 U$2.ENA
N$20
  Bottom 0.152: U$2.OUT1 34.4,23.61 R20.1
N$21
  Top 0.152: BALUN.1
  Top 0.254: BALUN.1 C26.2
N$22
  Top 0.152: MICROCONTROLLER.1 26.79,17.88 BALUN.4
N$23
  Top 0.152: MICROCONTROLLER.2 26.79,17.14 26.55,17.14 26.5,17.08 BALUN.3
N$24
  Top 0.152: MICROCONTROLLER.3 26.22,16.76 26.09,16.63 25.65,16.63 25.37,16.91 BALUN.2
N$25
  Bottom 0.254: GPS.32 22.52,9.7 R22.2
N$26
  Top 0.254: L2.1 18.96,20.58 | 18.96,20.58 19.33,20.58 R21.2 | 18.96,20.58 18.88,20.5 R13.1 18.56,20.5 U$3.SIG
N$27
  Top 0.254: R21.1 22.9,19.28 C26.1
N$28  (via drill 0.35)
  other vias: 41.04,6.91
N$29  (via drill 0.35)
  other vias: 38.13,4.01
N$30  (via drill 0.35)
  other vias: 38.19,0.88
N$31  (via drill 0.35)
  other vias: 35.6,0.86
N$32  (via drill 0.35)
  other vias: 33.53,2.26
N$33  (via drill 0.35)
  other vias: 13.14,19.11
N$34  (via drill 0.35)
  other vias: 13.19,16.82
N$35  (via drill 0.35)
  other vias: 13.19,14.21
N$36  (via drill 0.35)
  other vias: 13.19,11.7
N$37  (via drill 0.35)
  other vias: 13.27,8.84
N$38  (via drill 0.35)
  other vias: 48.53,9.58
N$39  (via drill 0.35)
  other vias: 13.08,22.72
N$41
  Top 0.254: R18.1 35.71,23.15 36.48,22.38 U$8.5
N$42  (via drill 0.35)
  other vias: 13.29,5.94
N$43  (via drill 0.35)
  other vias: 13.34,2.76
N$44  (via drill 0.35)
  other vias: 48.5,12.36
N$45  (via drill 0.35)
  other vias: 48.67,25.31
N$46  (via drill 0.35)
  other vias: 48.76,22.42
N$47  (via drill 0.35)
  other vias: 32.47,0.91
N$48
  Top 0.254: L4.1 37.78,21.65 U$8.7
NAV  (via drill 0.35)
  Top 0.152: v16.99,12.56 18.22,13.87 18.86,13.87 20.24,15.26 MICROCONTROLLER.6
  Bottom 0.152: GPS.7 26.55,22.2 R10.1 24.67,21.52 22.12,21.52 22.12,21.68 22.12,23.89 21.98,24.03 21.09,24.03 17.97,20.91 17.97,13.73 v16.99,12.56
PWM1  (via drill 0.35)
  Top 0.152: MICROCONTROLLER.40 31.51,19.45 v31.84,19.82
  Bottom 0.152: U$2.IN1 32.77,20.71 v31.84,19.82
PWM2  (via drill 0.35)
  Top 0.152: MICROCONTROLLER.41 31.02,19.44 v30.6,19.84
  Bottom 0.152: v30.6,19.84 32.27,21.51 U$2.IN2
RESET
  Top 0.152: U$1.13 48.11,17.77 47.82,17.97 U$1.14 42.46,17.97 40.54,16.05 R1.1 38.05,16.46 37.99,16.46 37.32,17.14 C1.1 37.02,17.26 MICROCONTROLLER.35
RLED
  Top 0.152: R4.2 25.4,12.76 MICROCONTROLLER.11
RXD  (via drill 0.35)
  Top 0.152: MICROCONTROLLER.7 20.3,14.76 18.78,13.24 v18.58,13.2 | v40.89,18.96 41.09,18.77 U$1.18 47.82,18.77 48.11,18.57 U$1.17
  Route2 0.152: v40.89,18.96 36.54,14.61 36.54,14.53 34.62,12.6 19.5,12.6 18.9,13.2 v18.58,13.2
  Bottom 0.152: GPS.44 20.38,18.88 19.21,18.88 18.55,17.57 v18.58,13.2
SCL
  Top 0.152: MICROCONTROLLER.9 20.73,13.76 20.55,13.58 R2.1 19.82,11.48 19.82,10.28 18.05,8.5 IMU.2
SDA  (via drill 0.35)
  Top 0.152: MICROCONTROLLER.10 22.01,13.26 21.85,13.11 21.85,12.22 R3.1 20.54,10.14 v20.34,9.86 | v17.52,9.88 17.18,9.54 IMU.4
  Bottom 0.152: 20.38,9.83 v20.34,9.86 19.68,9.87 v17.52,9.88
SOLAR_CELLS  (via drill 0.35)
  Top 0.152: REAR_PANEL.+ 33.4,27.66 | v33.41,25.55 v33.4,25.57
  Top 0.254: 40.4,26.74 39.46,27.68 34.98,27.68 | 34.98,27.68 33.42,27.68 33.4,27.66 | 35.04,27.62 34.98,27.68 | R18.2 33.41,24.45 v33.41,25.55 | L4.2 33.4,24.62 v33.4,25.57
  Top 0.406: C22.1 40.4,26.74
  Top 1.016: 33.4,27.66 v33.4,25.57
  Bottom 0.152: v33.4,25.57 33.24,25.5 | FRONT_PANEL.+ 33.4,27.67
  Bottom 1.016: 33.4,27.67 v33.4,25.57
SWO
  Top 0.152: U$1.11 48.12,17.37 47.82,17.57 47.41,17.57 | 47.41,17.57 U$1.12 | MICROCONTROLLER.28 38.81,13.76 42.63,17.58 47.4,17.58 47.41,17.57
TDI
  Top 0.152: U$1.9 48.12,16.97 47.82,17.17 U$1.10 42.76,17.17 38.85,13.26 MICROCONTROLLER.27
TDO
  Top 0.152: U$1.7 48.11,16.57 47.82,16.77 U$1.8 42.94,16.76 38.94,12.76 MICROCONTROLLER.26
TXD  (via drill 0.35)
  Top 0.152: MICROCONTROLLER.8 20.8,14.26 v19.75,13.21 | U$1.15 48.12,18.17 47.82,18.37 U$1.16 41.16,18.37 41.15,18.36 40.64,18.36 40.63,18.37 v39.43,18.37
  Route2 0.152: v39.43,18.37 36.24,15.18 36.24,14.65 34.8,13.21 v19.75,13.21
  Bottom 0.152: 19.32,16 R9.2 19.43,13.53 v19.75,13.21
VDDR  (via drill 0.35)
  Top 0.152: MICROCONTROLLER.45 29,21.07 29.45,21.5 30.74,21.51 L1.2 | MICROCONTROLLER.48 25.58,18.36 24.24,19.7 v24.24,20.72 | v27.94,24.35 29.04,24.35 29.08,24.31 29.14,24.24 arc90 C9.1 C8.1 30.86,23.15 30.93,23.08 C7.1 31.01,23.03 L1.2 | 30.91,21.29 L1.2
  Route2 0.152: v27.94,24.35 v24.24,20.72
VDDS  (via drill 0.35)
  Top 0.152: MICROCONTROLLER.44 29.51,20.36 v29.83,20.67 | MICROCONTROLLER.13 27.51,8.2 v26.87,7.52 | U$1.2 47.82,15.57 48.11,15.37 U$1.1 48.05,14.87 48.05,13.32 47.91,13.19 42.42,13.19 v40.23,10.97 | IMU.3 17.63,8.89 18.7,9.94 18.68,10.67 17.61,10.68 17.61,10.76 R6.1 17.47,11.44 v17.91,11.88 | MICROCONTROLLER.34 36.4,16.76 36.7,16.46 36.74,16.46 R1.2 37.16,15.32 v37.88,14.6 | v22.5,7.32 22.12,6.93 22.12,6.07 | IMU.23 20.53,4.47 21.94,5.89 22.03,5.97 22.12,6.07 | IMU.22 20.61,4.04 22.12,5.54 22.12,6.07 | IMU.1 18.62,8.12 v19.65,9.16 | MICROCONTROLLER.22 32,8.63 v31.69,8.43 | LS2.C v35.01,21.83
  Top 0.254: R2.2 R3.2 R6.1 | U$8.1 U$8.8 arc-90 38.67,19.59 v39.85,19.59 | C23.1 v42.02,24.09
  Route15 0.152: v29.83,20.67 30.11,20.63 | v37.88,14.6 38.22,14.6 | v19.65,9.16 19.58,9.08 | v17.91,11.88 18.21,11.88 | v31.69,8.43 31.69,8.13 | v40.23,10.97 40.1,10.79 | v22.5,7.32 22.61,7.25 | v26.87,7.52 26.86,7.28 | v39.85,19.59 39.95,19.71 | v22.52,20.84 22.64,20.97 | v24.36,22.22 24.36,22.36 | v35.01,21.83 35.06,21.81
  Route15 0.254: v42.02,24.09 41.98,24.37
  Bottom 0.152: GPS.58 28.02,14.09 GPS.18 30.8,13.7 30.86,13.7 31.69,12.86 v31.69,8.43 | R11.2 29.83,22.27 v29.83,20.67 | R11.2 30.67,23.11 U$2.VM | U$2.VCC 33.41,22.97 33.75,22.97 34.29,22.43 35.44,22.43 35.8,22.08 35.8,21.58 34.58,20.36 R19.2 34.63,19.59 C20.1 38.81,19.59 v39.85,19.59 | LED3.A 26.12,25.22 26.75,25.85 27.73,25.85 30.35,23.23 R11.2 | GPS.2 v22.52,20.84 | R12.1 v24.36,22.22
  Bottom 0.254: v37.88,14.6 37.07,13.79 LS1.C 33.82,12.2 C6.1 | C3.1 C2.1 C6.1 | C3.1 36.03,9.57 C4.1 | C4.1 C5.1 | C5.1 | C14.1 C15.1 C5.1 | C14.1 C13.1 | C6.1 C13.1 | C14.1 36.03,9.57 C4.1 | C13.1 C3.1 | U$4.VCC 39.85,21.12 v39.85,19.59
  pour Route15: 16.49,26.07 16.23,10.37 22.72,6.08 36.19,6.19 40.68,10.6 40.7,20.28 43.33,22.9 43.3,25.12 42.19,26.22 42.14,26.17 16.48,26.24
X24M_N
  Top 0.152: TSX3225.3 28.51,21.57 MICROCONTROLLER.46
X24M_P
  Top 0.152: MICROCONTROLLER.47 28.01,18.95 27.81,19.15 27.13,19.15 TSX3225.1

### Text on the board
tNames: Cornell University / / Space Systems / Design Studio
bNames: V. Hunter Adams / VHA3@CORNELL.EDU